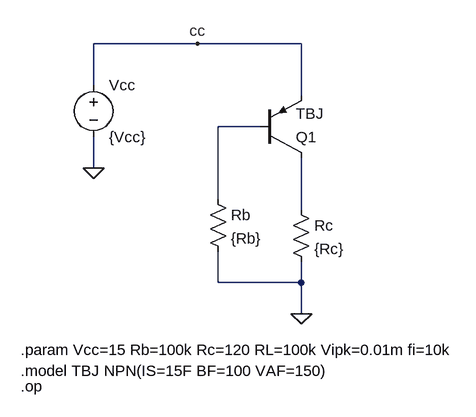
[diagram p0: schematic TBJ01bCAop.asc]
TBJ01bCAop.asc, the LTspice schematic file:
Version 4
SHEET 1 1608 1076
WIRE 128 -16 -32 -16
WIRE 288 -16 128 -16
WIRE -32 48 -32 -16
WIRE 288 64 288 -16
WIRE 224 112 160 112
WIRE -32 176 -32 128
WIRE 160 224 160 112
WIRE 288 240 288 160
WIRE 160 352 160 304
WIRE 288 352 288 320
WIRE 288 352 160 352
WIRE 288 400 288 352
FLAG -32 176 0
FLAG 288 400 0
FLAG 128 -16 cc
SYMBOL res 144 208 R0
SYMATTR InstName Rb
SYMATTR Value {Rb}
SYMBOL res 272 224 R0
SYMATTR InstName Rc
SYMATTR Value {Rc}
SYMBOL voltage -32 32 R0
WINDOW 123 0 0 Left 0
WINDOW 39 0 0 Left 0
SYMATTR InstName Vcc
SYMATTR Value {Vcc}
SYMBOL pnp 224 160 M180
SYMATTR InstName Q1
SYMATTR Value TBJ
TEXT -144 456 Left 2 !.param Vcc=15 Rb=100k Rc=120 RL=100k Vipk=0.01m fi=10k
TEXT -144 512 Left 2 !.op
TEXT -144 488 Left 2 !.model TBJ NPN(IS=15F BF=100 VAF=150)

The netlist it stands for:
* TBJ01bCAop.asc
Rb N001 0 {Rb}
Rc N002 0 {Rc}
Vcc cc 0 {Vcc}
Q1 N002 N001 cc 0 TBJ
.model NPN NPN
.model PNP PNP
.lib standard.bjt
.param Vcc=15 Rb=100k Rc=120 RL=100k Vipk=0.01m fi=10k
.op
.model TBJ NPN(IS=15F BF=100 VAF=150)
.backanno
.end